# Altium schematic sheet MainControler.SchDoc
size A2
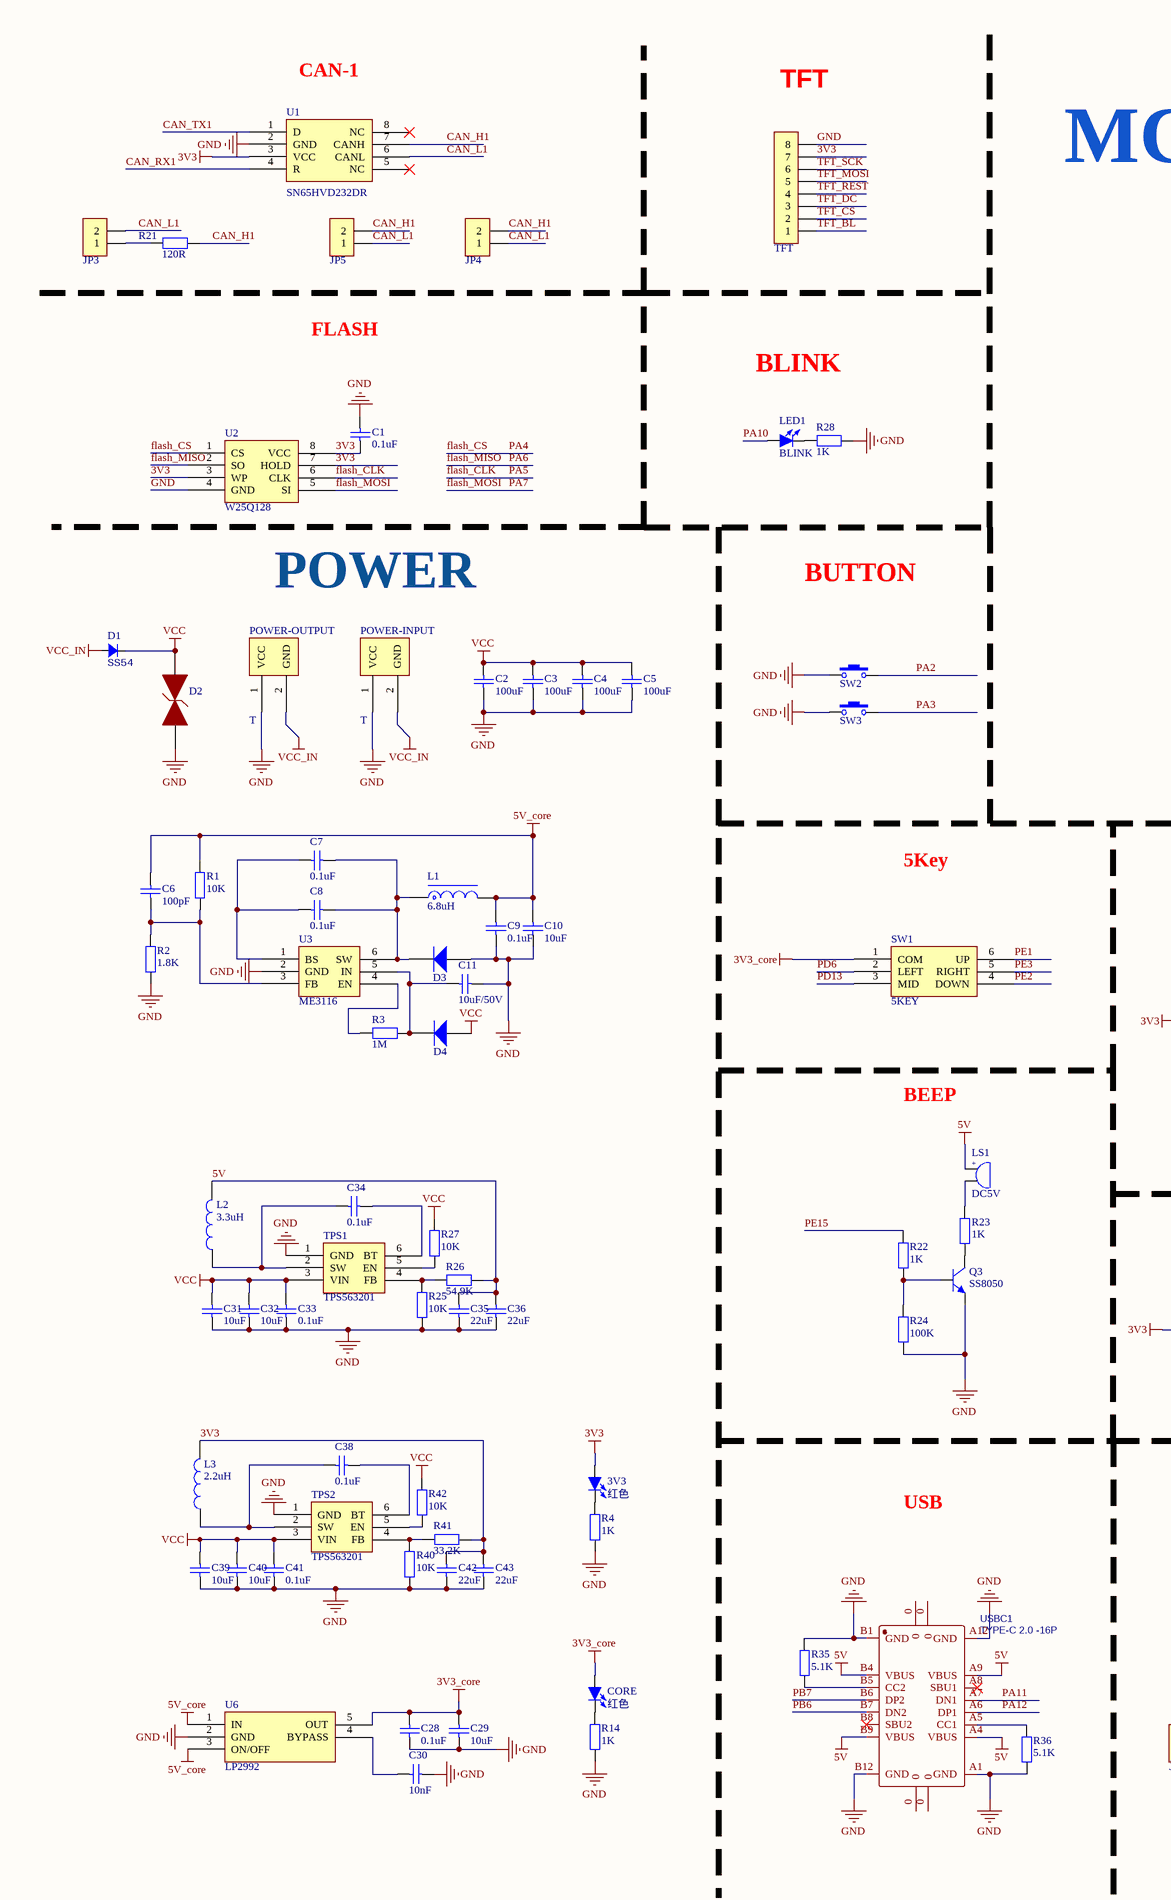
[diagram p0: MainControler.SchDoc, left]
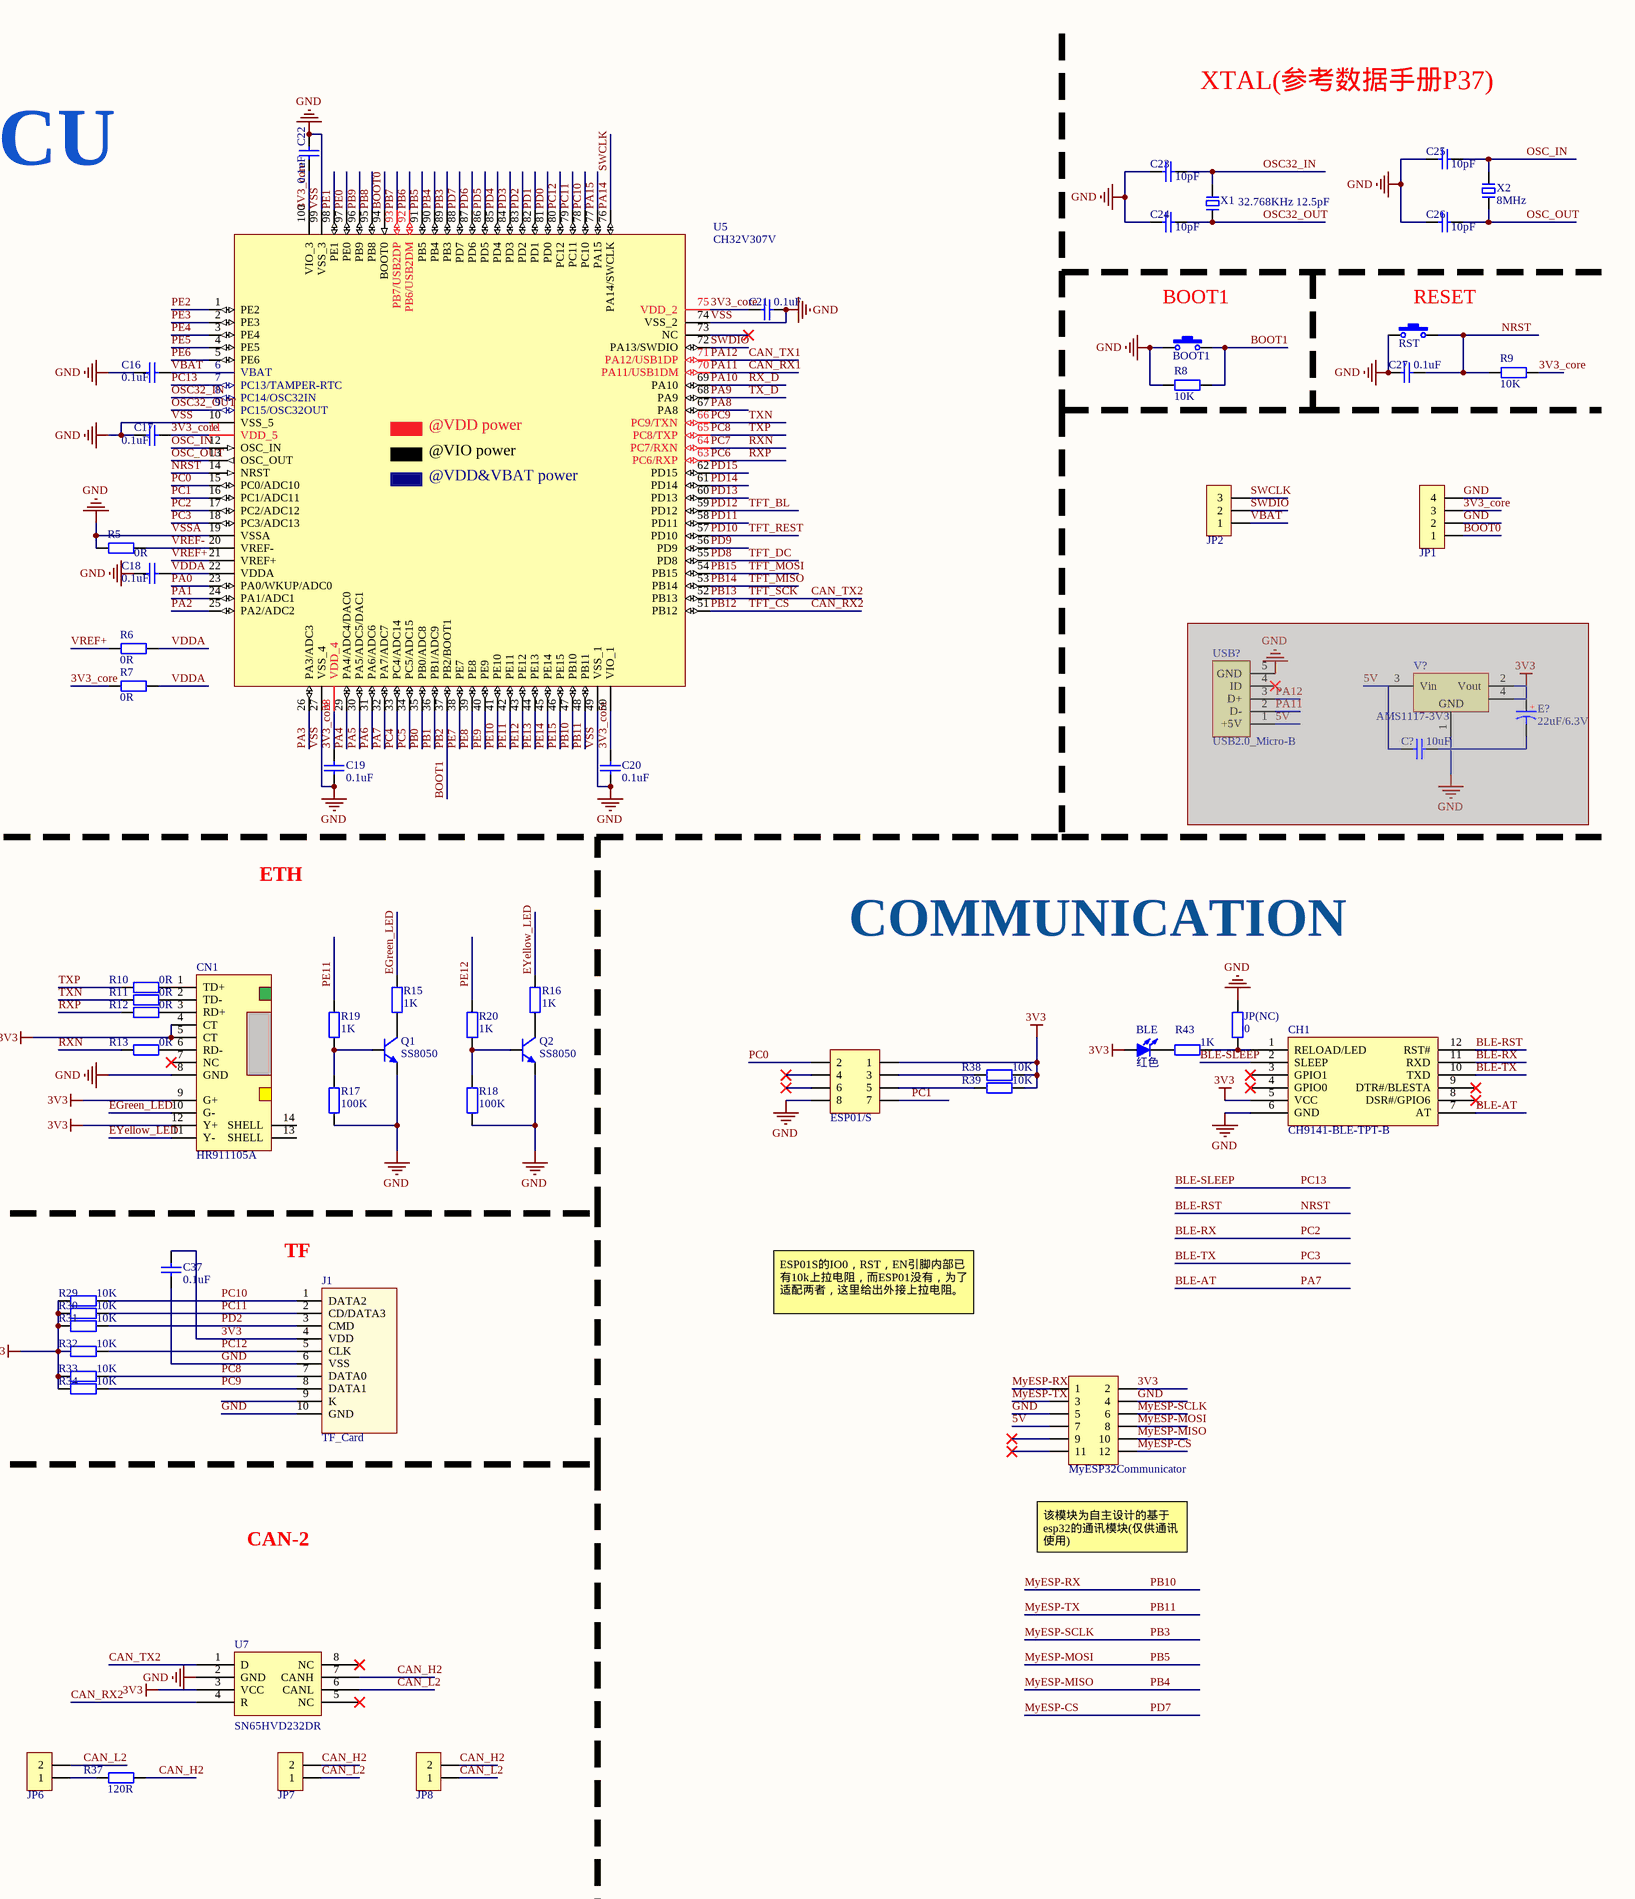
[diagram p1: MainControler.SchDoc, right]

## Parts
3V3  红色  [LED0805_G]
BLE  红色  [LED0805_G]
BOOT1  3x6x5  [SW SMD-3*6*4.3]  (value not drawn)
C1  0.1uF  [C0805_L]
C2  100uF  [C1206_L]
C3  100uF  [C1206_L]
C4  100uF  [C1206_L]
C5  100uF  [C1206_L]
C6  100pF  [C0402_L]
C7  0.1uF  [C0402_L]
C8  0.1uF  [C0402_L]
C9  0.1uF  [C0402_L]
C10  10uF  [C0402_L]
C11  10uF/50V  [C0603_L]
C16  0.1uF  [C0805_L]
C17  0.1uF  [C0805_L]
C18  0.1uF  [C0805_L]
C19  0.1uF  [C0805_L]
C20  0.1uF  [C0805_L]
C21  0.1uF  [C0805_L]
C22  0.1uF  [C0805_L]
C23  10pF  [C0805_L]
C24  10pF  [C0805_L]
C25  10pF  [C0805_L]
C26  10pF  [C0805_L]
C27  0.1uF  [C0805_L]
C28  0.1uF  [C0402_L]
C29  10uF  [C0402_L]
C30  10nF  [C0402_L]
C31  10uF  [C0805_L]
C32  10uF  [C0805_L]
C33  0.1uF  [C0805_L]
C34  0.1uF  [C0805_L]
C35  22uF  [C0805_L]
C36  22uF  [C0805_L]
C37  0.1uF  [C0805_L]
C38  0.1uF  [C0805_L]
C39  10uF  [C0805_L]
C40  10uF  [C0805_L]
C41  0.1uF  [C0805_L]
C42  22uF  [C0805_L]
C43  22uF  [C0805_L]
C?  10uF  [C0805_L]  (masked out: inside a compile mask, not in the netlist)
CH1  CH9141-BLE-TPT-B  [CH9141-BLE]
CN1  HR911105A  [RJ8-HR911105A]
CORE  红色  [LED0805_G]
D1  SS54  [SMA]
D2  SMBJ28CA  [SMB]  (value not drawn)
D3  二极管-5819W  [SOD-323]  (value not drawn)
D4  二极管-5819W  [SOD-323]  (value not drawn)
E?  22uF/6.3V  [C_3216]  (masked out: inside a compile mask, not in the netlist)
ESP01/S  Header 4X2  [HDR2.54-M-LS-2x4P]  (value not drawn)
J1  TF_Card  [Micro SD]
JP1  HDR-1X4  [HDR2.54-LI-4P]  (value not drawn)
JP2  HDR-1X3  [HDR2.54-LI-3P]  (value not drawn)
JP3  HDR-1X2  [HDR2.54-LI-2P]  (value not drawn)
JP4  CON-2P  [SH1.0-WT-2P]  (value not drawn)
JP5  CON-2P  [SH1.0-WT-2P]  (value not drawn)
JP6  HDR-1X2  [HDR2.54-LI-2P]  (value not drawn)
JP7  CON-2P  [SH1.0-WT-2P]  (value not drawn)
JP8  CON-2P  [SH1.0-WT-2P]  (value not drawn)
JP(NC)  0  [R0402_L]
L1  6.8uH  [L-SMD-0420]
L2  3.3uH  [L-SMD-0630]
L3  2.2uH  [L-SMD-0630]
LED1  BLINK  [LED0805_G]
LS1  DC5V  [BEEP 5x9x5.5]
MyESP32Communicator  Header 6X2  [HDR2.54-M-LS-2x6P]  (value not drawn)
POWER-INPUT  T  [T接头]
POWER-OUTPUT  T  [T接头]
Q1  SS8050  [SOT23-3N]
Q2  SS8050  [SOT23-3N]
Q3  SS8050  [SOT23-3N]
R1  10K  [R0402_L]
R2  1.8K  [R0402_L]
R3  1M  [R0402_L]
R4  1K  [R0402_L]
R5  0R  [R0805_L]
R6  0R  [R0805_L]
R7  0R  [R0805_L]
R8  10K  [R0805_L]
R9  10K  [R0805_L]
R10  0R  [R0805_L]
R11  0R  [R0805_L]
R12  0R  [R0805_L]
R13  0R  [R0805_L]
R14  1K  [R0402_L]
R15  1K  [R0402_L]
R16  1K  [R0402_L]
R17  100K  [R0402_L]
R18  100K  [R0402_L]
R19  1K  [R0402_L]
R20  1K  [R0402_L]
R21  120R  [R0402_L]
R22  1K  [R0402_L]
R23  1K  [R0402_L]
R24  100K  [R0402_L]
R25  10K  [R0603_L]
R26  54.9K  [R0603_L]
R27  10K  [R0603_L]
R28  1K  [R0402_L]
R29  10K  [R0402_L]
R30  10K  [R0402_L]
R31  10K  [R0402_L]
R32  10K  [R0402_L]
R33  10K  [R0402_L]
R34  10K  [R0402_L]
R35  5.1K  [R0402_L]
R36  5.1K  [R0402_L]
R37  120R  [R0402_L]
R38  10K  [R0402_L]
R39  10K  [R0402_L]
R40  10K  [R0603_L]
R41  33.2K  [R0603_L]
R42  10K  [R0603_L]
R43  1K  [R0402_L]
RST  3x6x5  [SW SMD-3*6*4.3]  (value not drawn)
SW1  5KEY  [SW 10x10x9-5Key-LS]
SW2  3x6x5  [SW SMD-3*6*4.3]  (value not drawn)
SW3  3x6x5  [SW SMD-3*6*4.3]  (value not drawn)
TFT  HDR-1X8  [HDR2.54-M-LI-8P]  (value not drawn)
TPS1  TPS563201  [SOT23-6N]
TPS2  TPS563201  [SOT23-6N]
U1  Manufacturer Part Number: SN65HVD232DR  [SOIC-8]  (hidden comment: SN65HVD232D)
U2  W25Q128  [SOIC-8]
U3  ME3116  [SOT23-6]
U5  CH32V307V  [LQFP100]
U6  LP2992  [SOT23-5]
U7  Manufacturer Part Number: SN65HVD232DR  [SOIC-8]  (hidden comment: SN65HVD232D)
USB?  USB2.0_Micro-B  [USB2.0_MICRO-B_1]  (masked out: inside a compile mask, not in the netlist)
USBC1  TYPE-C 2.0 -16P  [USB-C-SMD_TYPE-C-USB-5]
V?  AMS1117-3V3  [SOT223_L]  (masked out: inside a compile mask, not in the netlist)
X1  32.768KHz 12.5pF  [XTAL-3215-2P]
X2  8MHz  [XTAL-5032-2P]

## Nets
3V3: 3V3.1(A) BLE.1(A) C1.1 C37.1 C42.1 C43.1 CH1.5(VCC) CN1.4(CT) CN1.5(CT) CN1.9(G+) CN1.12(Y+) ESP01/S.1 J1.4(VDD) L3.2 MyESP32Communicator.2 R29.2 R30.2 R31.2 R32.2 R33.2 R34.2 R38.1 R39.1 R41.1 TFT.7 U1.3(VCC) U2.3(WP) U2.7(HOLD) U2.8(VCC) U7.3(VCC)
3V3_core: C17.1 C19.1 C20.1 C21.1 C22.1 C28.2 C29.2 CORE.1(A) JP1.3 R7.1 R9.2 SW1.1(COM) U5.11(VDD_5) U5.28(VDD_4) U5.50(VIO_1) U5.75(VDD_2) U5.100(VIO_3) U6.5(OUT)
5V: C35.1 C36.1 L2.2 LS1.1 MyESP32Communicator.7 R26.1 USBC1.A4(VBUS) USBC1.A9(VBUS) USBC1.B4(VBUS) USBC1.B9(VBUS)
5V_core: C6.2 C9.1 C10.2 L1.2 R1.2 U6.1(IN) U6.3(ON/OFF)
GND: BOOT1.1 C1.2 C2.1 C3.1 C4.1 C5.1 C9.2 C10.1 C11.1 C16.2 C17.2 C18.2 C19.2 C20.2 C21.2 C22.2 C23.1 C24.1 C25.1 C26.1 C27.1 C28.1 C29.1 C30.1 C31.1 C32.1 C33.1 C35.2 C36.2 C37.2 C39.1 C40.1 C41.1 C42.2 C43.2 CH1.6(GND) CN1.8(GND) D2.1 D3.1(A) ESP01/S.8 J1.6(VSS) J1.10(GND) JP1.2 JP1.4 JP(NC).1 MyESP32Communicator.4 MyESP32Communicator.5 POWER-INPUT.1(VCC) POWER-OUTPUT.1(VCC) Q1.2(E) Q2.2(E) Q3.2(E) R2.1 R4.1 R5.1 R8.1 R14.1 R17.1 R18.1 R24.1 R25.1 R28.2 R35.2 R36.1 R40.1 RST.1 SW2.1 SW3.1 TFT.8 TPS1.1(GND) TPS2.1(GND) U1.2(GND) U2.4(GND) U3.2(GND) U5.10(VSS_5) U5.19(VSSA) U5.27(VSS_4) U5.49(VSS_1) U5.74(VSS_2) U5.99(VSS_3) U6.2(GND) U7.2(GND) USBC1.A1(GND) USBC1.A12(GND) USBC1.B1(GND) USBC1.B12(GND)  [also labelled VSS, VSSA]
VCC: C2.2 C3.2 C4.2 C5.2 C31.2 C32.2 C33.2 C39.2 C40.2 C41.2 D1.2(K) D2.2 D4.1(A) R27.2 R42.2 TPS1.3(VIN) TPS2.3(VIN)
VCC_IN: D1.1(A) POWER-INPUT.2(GND) POWER-OUTPUT.2(GND)
BLE-AT: CH1.7(AT) U2.5(SI) U5.32(PA7/ADC7)  [also labelled flash_MOSI, PA7]
BLE-RST: C27.2 CH1.12(RST#) R9.1 RST.2 U5.14(NRST)  [also labelled NRST]
BLE-RX: CH1.11(RXD) U5.17(PC2/ADC12)  [also labelled PC2]
BLE-SLEEP: CH1.2(SLEEP) U5.7(PC13/TAMPER-RTC)  [also labelled PC13]
BLE-TX: CH1.10(TXD) U5.18(PC3/ADC13)  [also labelled PC3]
BOOT0: JP1.1 U5.94(BOOT0)
BOOT1: BOOT1.2 R8.2 U5.37(PB2/BOOT1)  [also labelled PB2]
CAN_H1: JP4.2 JP5.2 R21.1 U1.7(CANH)
CAN_H2: JP7.2 JP8.2 R37.1 U7.7(CANH)
CAN_L1: JP3.2 JP4.1 JP5.1 U1.6(CANL)
CAN_L2: JP6.2 JP7.1 JP8.1 U7.6(CANL)
CAN_RX1: U1.4(R) U5.70(PA11/USB1DM) USBC1.A7(DN1)  [also labelled PA11]
CAN_RX2: TFT.2 U5.51(PB12) U7.4(R)  [also labelled PB12, TFT_CS]
CAN_TX1: U1.1(D) U5.71(PA12/USB1DP) USBC1.A6(DP1)  [also labelled PA12]
CAN_TX2: TFT.6 U5.52(PB13) U7.1(D)  [also labelled PB13, TFT_SCK]
EGreen_LED: CN1.10(G-) R15.1
EYellow_LED: CN1.11(Y-) R16.2
flash_CLK: U2.6(CLK) U5.30(PA5/ADC5/DAC1)  [also labelled PA5]
flash_CS: U2.1(CS) U5.29(PA4/ADC4/DAC0)  [also labelled PA4]
flash_MISO: U2.2(SO) U5.31(PA6/ADC6)  [also labelled PA6]
MyESP-CS: MyESP32Communicator.12 U5.88(PD7)  [also labelled PD7]
MyESP-MISO: MyESP32Communicator.10 U5.90(PB4)  [also labelled PB4]
MyESP-MOSI: MyESP32Communicator.8 U5.91(PB5)  [also labelled PB5]
MyESP-RX: MyESP32Communicator.1 U5.47(PB10)  [also labelled PB10]
MyESP-SCLK: MyESP32Communicator.6 U5.89(PB3)  [also labelled PB3]
MyESP-TX: MyESP32Communicator.3 U5.48(PB11)  [also labelled PB11]
OSC32_IN: C23.2 U5.8(PC14/OSC32IN) X1.2
OSC32_OUT: C24.2 U5.9(PC15/OSC32OUT) X1.1
OSC_IN: C25.2 U5.12(OSC_IN) X2.2
OSC_OUT: C26.2 U5.13(OSC_OUT) X2.1
PA0: U5.23(PA0/WKUP/ADC0)
PA1: U5.24(PA1/ADC1)
PA2: SW2.2 U5.25(PA2/ADC2)
PA3: SW3.2 U5.26(PA3/ADC3)
PA8: U5.67(PA8)
PA9: U5.68(PA9)  [also labelled TX_D]
PA10: LED1.1(A) U5.69(PA10)  [also labelled RX_D]
PA14: JP2.3 U5.76(PA14/SWCLK)  [also labelled SWCLK]
PA15: U5.77(PA15)
PB0: U5.35(PB0/ADC8)
PB1: U5.36(PB1/ADC9)
PB6: U5.92(PB6/USB2DM) USBC1.B7(DN2)
PB7: U5.93(PB7/USB2DP) USBC1.B6(DP2)
PB8: U5.95(PB8)
PB9: U5.96(PB9)
PB14: U5.53(PB14)  [also labelled TFT_MISO]
PB15: TFT.5 U5.54(PB15)  [also labelled TFT_MOSI]
PC0: ESP01/S.2 U5.15(PC0/ADC10)
PC1: ESP01/S.7 U5.16(PC1/ADC11)
PC4: U5.33(PC4/ADC14)
PC5: U5.34(PC5/ADC15)
PC6: R12.1 U5.63(PC6/RXP)  [also labelled RXP]
PC7: R13.1 U5.64(PC7/RXN)  [also labelled RXN]
PC8: J1.7(DATA0) R10.1 R33.1 U5.65(PC8/TXP)  [also labelled TXP]
PC9: J1.8(DATA1) R11.1 R34.1 U5.66(PC9/TXN)  [also labelled TXN]
PC10: J1.1(DATA2) R29.1 U5.78(PC10)
PC11: J1.2(CD/DATA3) R30.1 U5.79(PC11)
PC12: J1.5(CLK) R32.1 U5.80(PC12)
PD0: U5.81(PD0)
PD1: U5.82(PD1)
PD2: J1.3(CMD) R31.1 U5.83(PD2)
PD3: U5.84(PD3)
PD4: U5.85(PD4)
PD5: U5.86(PD5)
PD6: SW1.2(LEFT) U5.87(PD6)
PD8: TFT.3 U5.55(PD8)  [also labelled TFT_DC]
PD9: U5.56(PD9)
PD10: TFT.4 U5.57(PD10)  [also labelled TFT_REST]
PD11: U5.58(PD11)
PD12: TFT.1 U5.59(PD12)  [also labelled TFT_BL]
PD13: SW1.3(MID) U5.60(PD13)
PD14: U5.61(PD14)
PD15: U5.62(PD15)
PE0: U5.97(PE0)
PE1: SW1.6(UP) U5.98(PE1)
PE2: SW1.4(DOWN) U5.1(PE2)
PE3: SW1.5(RIGHT) U5.2(PE3)
PE4: U5.3(PE4)
PE5: U5.4(PE5)
PE6: U5.5(PE6)
PE7: U5.38(PE7)
PE8: U5.39(PE8)
PE9: U5.40(PE9)
PE10: U5.41(PE10)
PE11: R19.1 U5.42(PE11)
PE12: R20.1 U5.43(PE12)
PE13: U5.44(PE13)
PE14: U5.45(PE14)
PE15: R22.1 U5.46(PE15)
SWDIO: JP2.2 U5.72(PA13/SWDIO)
VBAT: C16.1 JP2.1 U5.6(VBAT)
VDDA: C18.1 R6.2 R7.2 U5.22(VDDA)
VREF+: R6.1 U5.21(VREF+)
VREF-: R5.2 U5.20(VREF-)
Net3V3_2: 3V3.2(K) R4.2
NetBLE_2: BLE.2(K) R43.2
NetC6_1: C6.1 R1.1 R2.2 U3.3(FB)
NetC7_1: C7.1 C8.1 D3.2(K) L1.1 U3.6(SW)
NetC7_2: C7.2 C8.2 U3.1(BS)
NetC11_2: C11.2 D4.2(K) R3.2 U3.5(IN)
NetC30_2: C30.2 U6.4(BYPASS)
NetC34_1: C34.1 L2.1 TPS1.2(SW)
NetC34_2: C34.2 TPS1.6(BT)
NetC38_1: C38.1 L3.1 TPS2.2(SW)
NetC38_2: C38.2 TPS2.6(BT)
NetCH1_1: CH1.1(RELOAD/LED) JP(NC).2 R43.1
NetCN1_1: CN1.1(TD+) R10.2
NetCN1_2: CN1.2(TD-) R11.2
NetCN1_3: CN1.3(RD+) R12.2
NetCN1_6: CN1.6(RD-) R13.2
NetCORE_2: CORE.2(K) R14.2
NetESP01/S_3: ESP01/S.3 R38.2
NetESP01/S_5: ESP01/S.5 R39.2
NetJP3_1: JP3.1 R21.2
NetJP6_1: JP6.1 R37.2
NetLED1_2: LED1.2(K) R28.1
NetLS1_2: LS1.2 R23.2
NetQ1_1: Q1.1(B) R17.2 R19.2
NetQ1_3: Q1.3(C) R15.2
NetQ2_1: Q2.1(B) R18.2 R20.2
NetQ2_3: Q2.3(C) R16.1
NetQ3_1: Q3.1(B) R22.2 R24.2
NetQ3_3: Q3.3(C) R23.1
NetR3_1: R3.1 U3.4(EN)
NetR25_2: R25.2 R26.2 TPS1.4(FB)
NetR27_1: R27.1 TPS1.5(EN)
NetR35_1: R35.1 USBC1.B5(CC2)
NetR36_2: R36.2 USBC1.A5(CC1)
NetR40_2: R40.2 R41.2 TPS2.4(FB)
NetR42_1: R42.1 TPS2.5(EN)

Not connected (* = marked no-connect by the designer): CH1 3(GPIO1)* 4(GPIO0)* 8(DSR#/GPIO6)* 9(DTR#/BLESTA)*; CN1 7(NC)* 13(SHELL) 14(SHELL); ESP01/S 4* 6*; J1 9(K); MyESP32Communicator 9* 11*; U1 5(NC)* 8(NC)*; U5 73(NC)*; U7 5(NC)* 8(NC)*; USBC1 0 A8(SBU1)* B8(SBU2)*

## Notes on the sheet
- CAN-1
- TFT
- XTAL(参考数据手册P37)
- MCU
- FLASH
- (near BOOT1) BOOT1
- (near RST) RESET
- BLINK
- POWER
- BUTTON
- 5Key
- ETH
- COMMUNICATION
- BEEP
- (near J1) TF
- ESP01S的IO0，RST，EN引脚内部已有10k上拉电阻，而ESP01没有，为了适配两者，这里给出外接上拉电阻。
- USB
- CAN-2
- 该模块为自主设计的基于esp32的通讯模块(仅供通讯使用)
- Title
- Size:
- Date:
- File:
- A2
- Number:
- Time:
- Revision:
- Sheet
- of
- (in symbol BEEP) +
- (in symbol CH32V307V) @VDD power; @VIO power; @VDD&VBAT power
- (in symbol CT) +

## Library data of the parts
3V3 BLE CORE LED1 = LED-SMD: 贴片LED; 封装库来自淘宝卖家ID：黄晶宝石: 其他店铺购入均为盗版封装库，请立即申请退款，本店现金奖励20~200元; BOM名称: 贴片LED
BOOT1 RST SW2 SW3 = SW-PB: 微动开关; BOM名称: 3x6轻触开关; 联系卖家，免费查找封装: 唯一出售店铺网址https://shop463601444.taobao.com; 封装库来自淘宝卖家ID：黄晶宝石: 其他店铺购入的，请立即申请退款，本店现金奖励20~500元
C1-C10 C16-C43 C? = C: 贴片电容/MLCC电容; BOM名称: 无极性贴片电容; 联系卖家，免费查找封装: 唯一出售店铺网址https://shop463601444.taobao.com
C11 = C: 陶瓷电容; BOM名称: 无极性贴片电容; 联系卖家，免费查找封装: 唯一出售店铺网址https://shop463601444.taobao.com
CH1 = CH9141-BLE-TPT
CN1 = HR911105A: 带灯以太网接口; 联系卖家 免费技术支持: 封装库来自淘宝卖家ID：黄晶宝石
D1 = Diode_SMA: Diode; Value: SS54; Type: SMA
D3 D4 = 二极管-5819W: 40V
E? = CT: 贴片钽电容; 联系卖家，免费查找封装: 唯一出售店铺网址https://shop463601444.taobao.com; BOM名称: 贴片钽电容
ESP01/S = Header 4X2: 4*2P接插件; 版权归属: 封装库来自淘宝 ID：黄晶宝石; BOM名称: 4*2P接插件; 学习资源: https://shop463601444.taobao.com
J1 = TF_Card: TF卡座; 联系卖家 免费技术支持: 封装库来自淘宝卖家ID：黄晶宝石; BOM名称: TF卡座
JP1 = Header 4: 4P接插件; 联系卖家，免费查找封装: 唯一出售店铺网址https://shop463601444.taobao.com; 封装库来自淘宝卖家ID:黄晶宝石: 其他店铺购入均为盗版假冒封装库，请立即申请退款，本店现金奖励20~200元; BOM名称: 4P接插件
JP2 = Header 3: 3P接插件; 联系卖家，免费查找封装: 唯一出售店铺网址https://shop463601444.taobao.com; 封装库来自淘宝卖家ID:黄晶宝石: 其他店铺购入均为盗版假冒封装库，请立即申请退款，本店现金奖励20~200元; BOM名称: 3P接插件
JP3 JP6 = Header 2: 2P接插件; 联系卖家，免费查找封装: 唯一出售店铺网址https://shop463601444.taobao.com; 封装库来自淘宝卖家ID:黄晶宝石: 其他店铺购入均为盗版假冒封装库，请立即申请退款，本店现金奖励20~200元; BOM名称: 2P接插件
JP4 JP5 JP7 JP8 = Header 2: 2P连接器; 联系卖家 免费查找封装: 唯一出售店铺网址https://shop463601444.taobao.com; 联系卖家 免费技术支持: 封装库来自淘宝卖家ID：黄晶宝石; BOM名称: 2P连接器
JP(NC) R1-R43 = R: 贴片电阻; 联系卖家，免费查找封装: 唯一出售店铺网址https://shop463601444.taobao.com; BOM名称: 贴片电阻
L1 = L-Molding Choke: 一体成型电感; 联系卖家，免费查找封装: 唯一出售店铺网址https://shop463601444.taobao.com; BOM名称: 一体成型电感
L2 L3 = L: 贴片小功率电感; BOM名称: 小功率贴片电感; 联系卖家，免费查找封装: 唯一出售店铺网址https://shop463601444.taobao.com
LS1 = BEEP: 蜂鸣器; 联系卖家，免费查找封装: 唯一出售店铺网址https://shop463601444.taobao.com; 封装库来自淘宝卖家ID：黄晶宝石: 其他店铺购入的，请立即申请退款，本店现金奖励20~500元; BOM名称: 蜂鸣器
MyESP32Communicator = Header  6X2: 6*2P接插件; 版权归属: 封装库来自淘宝 ID：黄晶宝石; BOM名称: 6*2P接插件; 学习资源: https://shop463601444.taobao.com
POWER-INPUT POWER-OUTPUT = T接头
Q1-Q3 = 8050-SMD: 高频放大-NPN型; 参数: 40V 1.5A 1W 100MHZ; 以赠品形式获赠 本封装库的买家: 还可以联系卖家远程指导AD软件使用; BOM名称: 高频放大-NPN型
SW1 = five_key
TFT = Header 8: 8P接插件; 联系卖家，免费查找封装: 唯一出售店铺网址https://shop463601444.taobao.com; 封装库来自淘宝卖家ID:黄晶宝石: 其他店铺购入均为盗版假冒封装库，请立即申请退款，本店现金奖励20~200元; BOM名称: 8P接插件
TPS1 TPS2 = tps
U1 U7 = SN65HVD232D: Manufacturer: Texas Instruments; Protocol: CAN; Number of Drivers/Receivers: 1/1; Duplex: Half; Data Rate: 1Mbps; Voltage - Supply: 3 V ~ 3.6 V; Supplier 1: Digi-Key; Supplier Part Number 1: 296-26344-2-ND; RoHS: RoHS Compliant; Category: Integrated Circuits (ICs); Stock: 5000; Pricing 1: 2500=0.84375 (USD); Packaging: Tape & Reel (TR); Part Status: Active; Type: Transceiver; Operating Temperature: -40°C ~ 85°C; Mounting Type: Surface Mount; Package / Case: 8-SOIC (0.154", 3.90mm Width); Supplier Device Package: 8-SOIC; ComponentLink1URL: http://www.ti.com/lit/ds/symlink/sn65hvd230.pdf; ComponentLink1Description: http://www.ti.com/lit/ds/symlink/sn65hvd230.pdf; Supplier 2: Digi-Key; Supplier Part Number 2: 296-26344-1-ND; Pricing 2: 1=2.05, 10=1.842, 100=1.4809, 500=1.21668, 1000=1.00811 (USD)
U2 = MyDesign
U5 = CH32V307V: RISC-V FPU HD-MCU, 144MHz, USB_480M, USB OTG, 1000M Ethernet MAC, 2*CAN, FSMC+DVP
USB? = USB2.0_Micro-B: USB2.0_Micro-B母座; 联系卖家 免费技术支持: 封装库来自淘宝卖家ID：黄晶宝石; BOM名称: USB2.0_Micro-B母座
USBC1 = USB2.0 Type-C 16Pin母座: USB2.0 Type-C 母座 16Pin; BOM_Manufacturer: LCSC; BOM_Supplier: LCSC; BOM_Manufacturer Part: -; spicePre: U; spiceSymbolName: TYPE-C 3.1 -16P_C168689
V? = AMS1117: 三端稳压芯片; BOM名称: 稳压芯片; 封装库来自淘宝卖家ID：黄晶宝石: 其他店铺购入的买家，请立即申请退款，本店现金奖励20~1000元
X1 X2 = XTAL-2P: 2脚无源晶振(谐振器）; 联系卖家，免费查找封装: 唯一出售店铺网址https://shop463601444.taobao.com; BOM名称: 2脚无源晶振(谐振器）